# EAGLE schematic AliCampoPesca (EAGLE 7.2.0)
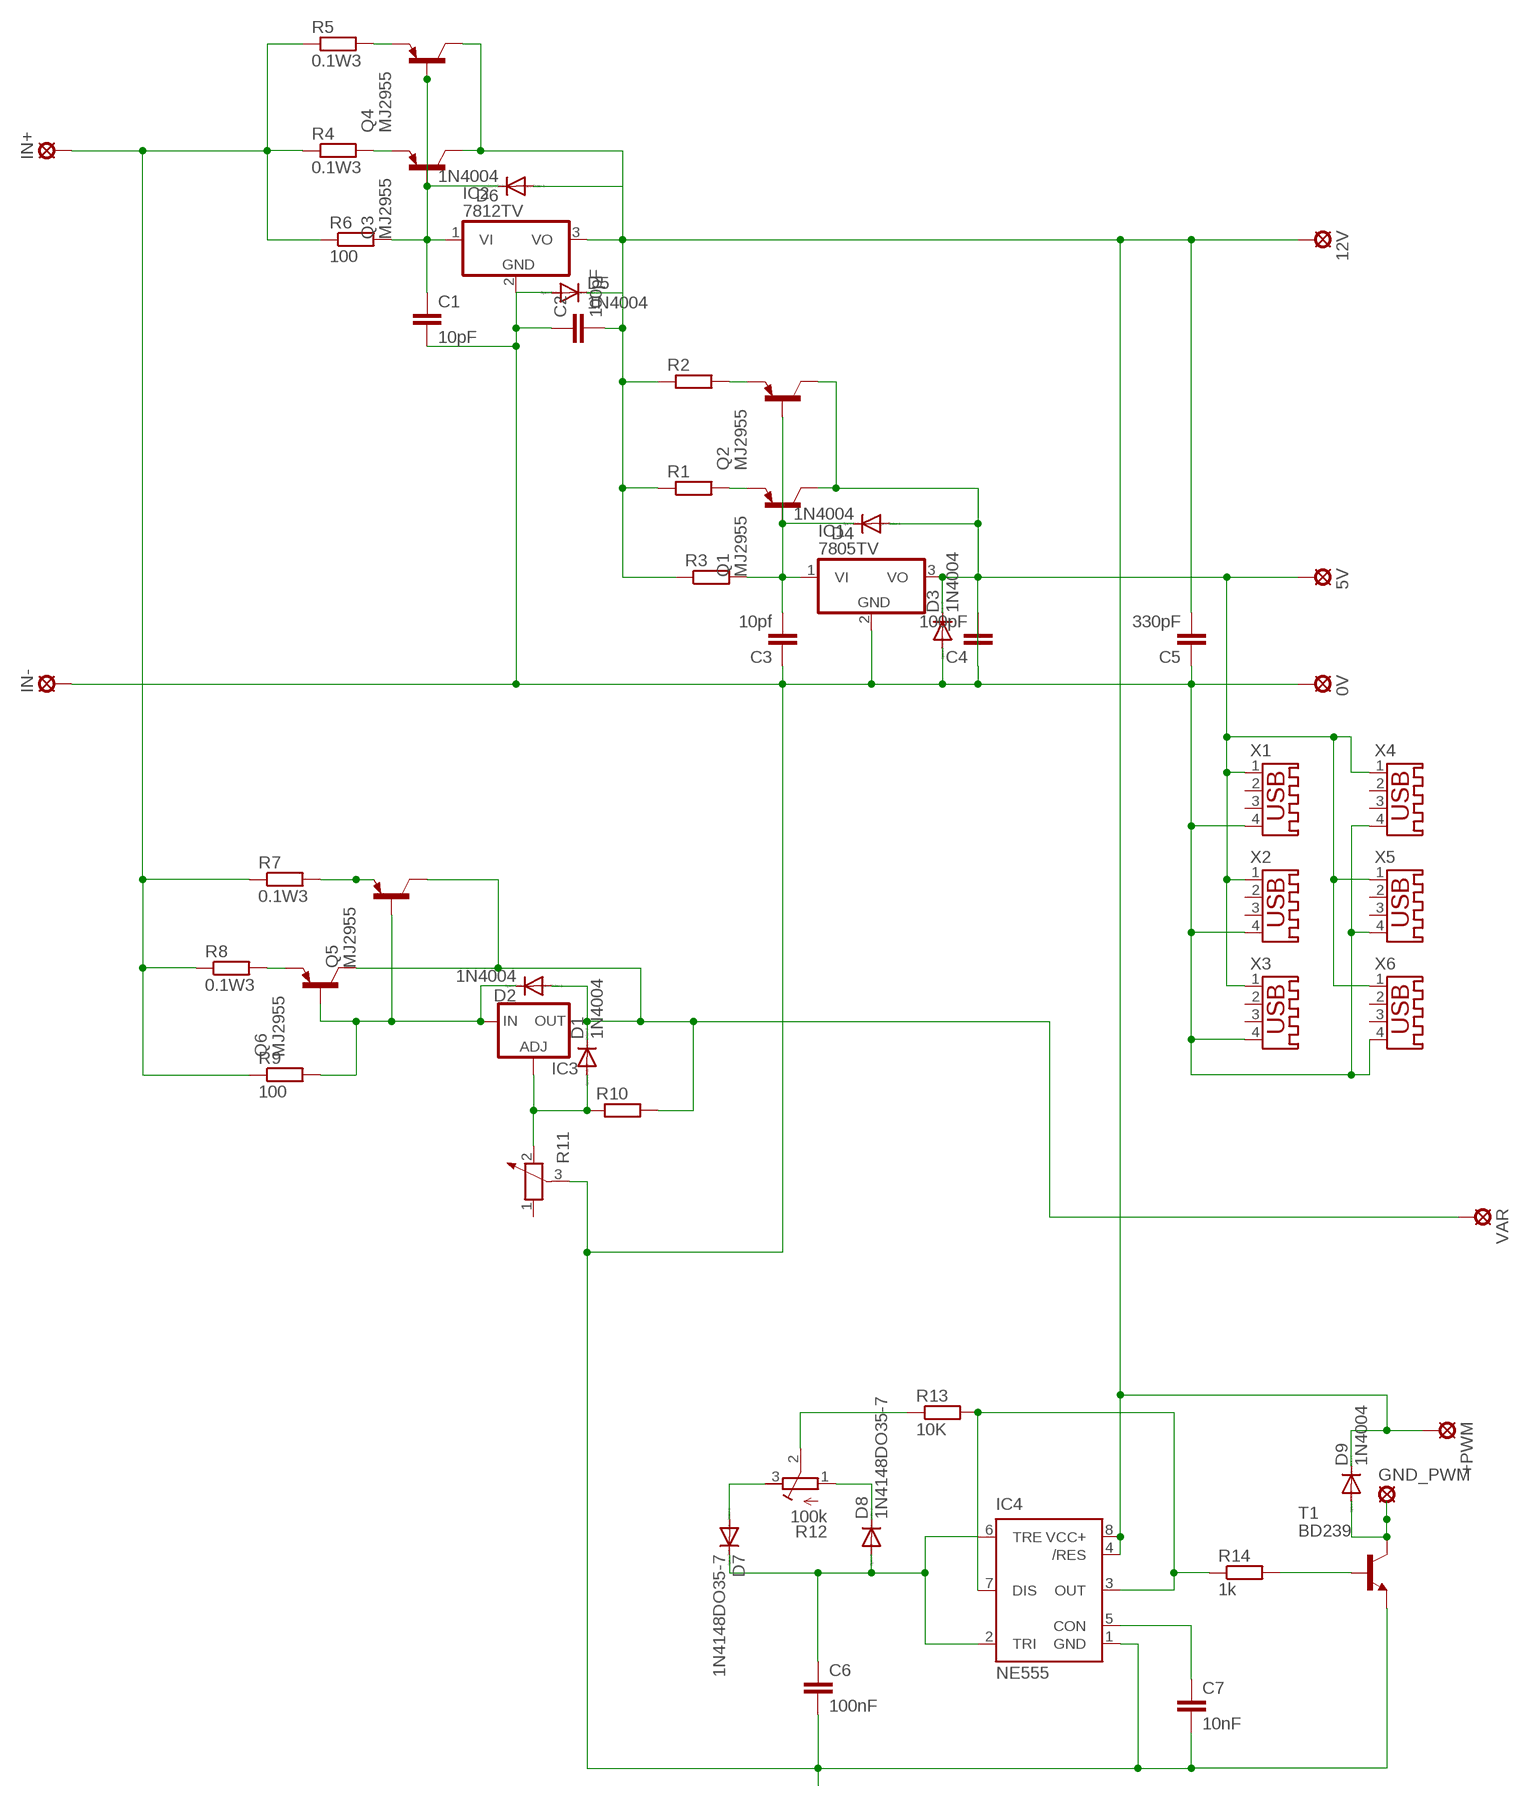
[diagram p0: schematic, sheet 1]

## Parts
0V  SE14  [SE14]
5V  SE14  [SE14]
12V  SE14  [SE14]
+PWM  LSP10  [LSP10]
C1  10pF  C-EU050-024X044  [C050-024X044]
C2  100pF  C-EU050-024X044  [C050-024X044]
C3  10pf  C-EU050-024X044  [C050-024X044]
C4  100pF  C-EU050-024X044  [C050-024X044]
C5  330pF  C-EU050-024X044  [C050-024X044]
C6  100nF  C-EU050-024X044  [C050-024X044]
C7  10nF  C-EU050-024X044  [C050-024X044]
D1  1N4004  [DO41-10]
D2  1N4004  [DO41-10]
D3  1N4004  [DO41-10]
D4  1N4004  [DO41-10]
D5  1N4004  [DO41-10]
D6  1N4004  [DO41-10]
D7  1N4148DO35-7  [DO35-7]
D8  1N4148DO35-7  [DO35-7]
D9  1N4004  [DO41-10]
GND_PWM  LSP10  [LSP10]
IC1  7805TV  [TO220V]
IC2  7812TV  [TO220V]
IC3  LM317TS  [317TS]
IC4  NE555  [DIL-08]
IN+  SE14  [SE14]
IN-  SE14  [SE14]
Q1  MJ2955  [TO3]
Q2  MJ2955  [TO3]
Q3  MJ2955  [TO3]
Q4  MJ2955  [TO3]
Q5  MJ2955  [TO3]
Q6  MJ2955  [TO3]
R1  R-EU_0207/15  [0207/15]
R2  R-EU_0207/15  [0207/15]
R3  R-EU_0207/15  [0207/15]
R4  0.1W3  R-EU_0207/15  [0207/15]
R5  0.1W3  R-EU_0207/15  [0207/15]
R6  100  R-EU_0207/15  [0207/15]
R7  0.1W3  R-EU_0207/15  [0207/15]
R8  0.1W3  R-EU_0207/15  [0207/15]
R9  100  R-EU_0207/15  [0207/15]
R10  R-EU_0207/12  [0207/12]
R11  POTENTIOMETER_PT-10  [PT-10]
R12  100k  R-TRIMM3339P  [RTRIM3339P]
R13  10K  R-EU_0204/7  [0204/7]
R14  1k  R-EU_0207/10  [0207/10]
T1  BD239  [TO220]
VAR  SE14  [SE14]
X1  USB-A003  [USB-A003]
X2  USB-A003  [USB-A003]
X3  USB-A003  [USB-A003]
X4  USB-A003  [USB-A003]
X5  USB-A003  [USB-A003]
X6  USB-A003  [USB-A003]

## Nets
N$1: D2.C IC3.3(IN) Q5.B Q6.B R9.2
N$2: D7.A R12.3(E)
N$3: Q1.E R1.2
N$4: Q2.E R2.2
N$5: C3.2 D4.C IC1.1(VI) Q1.B Q2.B R3.2
N$6: D1.A IC3.1(ADJ) R10.1 R11.2
N$7: D1.C D2.A IC3.2(OUT) Q5.C Q5.C/(C) Q6.C Q6.C/(C) R10.2 VAR.MP
N$8: IN+.MP R4.1 R5.1 R6.1 R7.1 R8.1 R9.1
N$9: Q3.E R4.2
N$10: Q4.E R5.2
N$11: C1.1 D6.C IC2.1(VI) Q3.B Q4.B R6.2
N$13: 0V.MP 5V.MP C1.2 C2.1 C3.1 C4.1 C4.2 C5.1 C6.2 C7.2 D3.A D3.C D4.A D5.A IC1.2(GND) IC1.3(VO) IC2.2(GND) IC4.1(GND) IN-.MP Q1.C Q1.C/(C) Q2.C Q2.C/(C) R11.3 T1.3(E) X1.1 X1.4 X2.1 X2.4 X3.1 X3.4 X4.1 X4.4 X5.1 X5.4 X6.1 X6.4
N$14: D8.C R12.1(A)
N$15: Q5.E R7.2
N$16: C6.1 D7.C D8.A IC4.2(TRI) IC4.6(TRE)
N$17: Q6.E R8.2
N$18: C7.1 IC4.5(CON)
N$19: 12V.MP +PWM.MP C2.2 C5.2 D5.C D6.A D9.C IC2.3(VO) IC4.4(/RES) IC4.8(VCC+) Q3.C Q3.C/(C) Q4.C Q4.C/(C) R1.1 R2.1 R3.1
N$20: R12.2(S) R13.1
N$21: R14.2 T1.1(B)
N$22: D9.A GND_PWM.MP T1.2(C)
N$24: IC4.3(OUT) IC4.7(DIS) R13.2 R14.1
Unconnected: R11.1 X1.2 X1.3 X2.2 X2.3 X3.2 X3.3 X4.2 X4.3 X5.2 X5.3 X6.2 X6.3

## Library data of the parts
0V 5V 12V IN+ IN- VAR = solpad:SE14: SOLDER PAD E1553, drill 1,4mm, distributor Buerklin, 07F820
+PWM GND_PWM = solpad:LSP10: SOLDER PAD drill 1.0 mm, distributor Buerklin, 12H555
C1-C7 = rcl:C-EU: CAPACITOR, European symbol
D1-D6 D9 = diode:1N4004: DIODE general purpose rectifier, 1 A
D7 D8 = diode:1N4148: DIODE high speed (Philips)
IC1 IC2 = linear:78*: Positive VOLTAGE REGULATOR Source: http://cache.national.com/ds/LM/LM78L05.pdf http://www.fairchildsemi.com/ds/LM/LM7805.pdf
IC3 = v-reg:LM317TS: VOLTAGE REGULATOR
IC4 = st-microelectronics:NE555: General purpose bipolar Timer; MF: Arrow Electronics; MPN: NE555N; OC_FARNELL: 1467742; OC_NEWARK: 89K1486
Q1-Q6 = transistor-pnp:MJ2955: PNP Transistor
R1-R10 R13 R14 = rcl:R-EU_: RESISTOR, European symbol
R11 = rcl:POTENTIOMETER_: Potentiometer
R12 = rcl:R-TRIMM: Trimm resistor
T1 = transistor-npn:BD239*: NPN Transistor
X1-X6 = con-yamaichi:USB-A003: USB connector; OC_FARNELL: unknown; OC_NEWARK: unknown